# EAGLE design Akvarij1_0 (EAGLE 5.10)
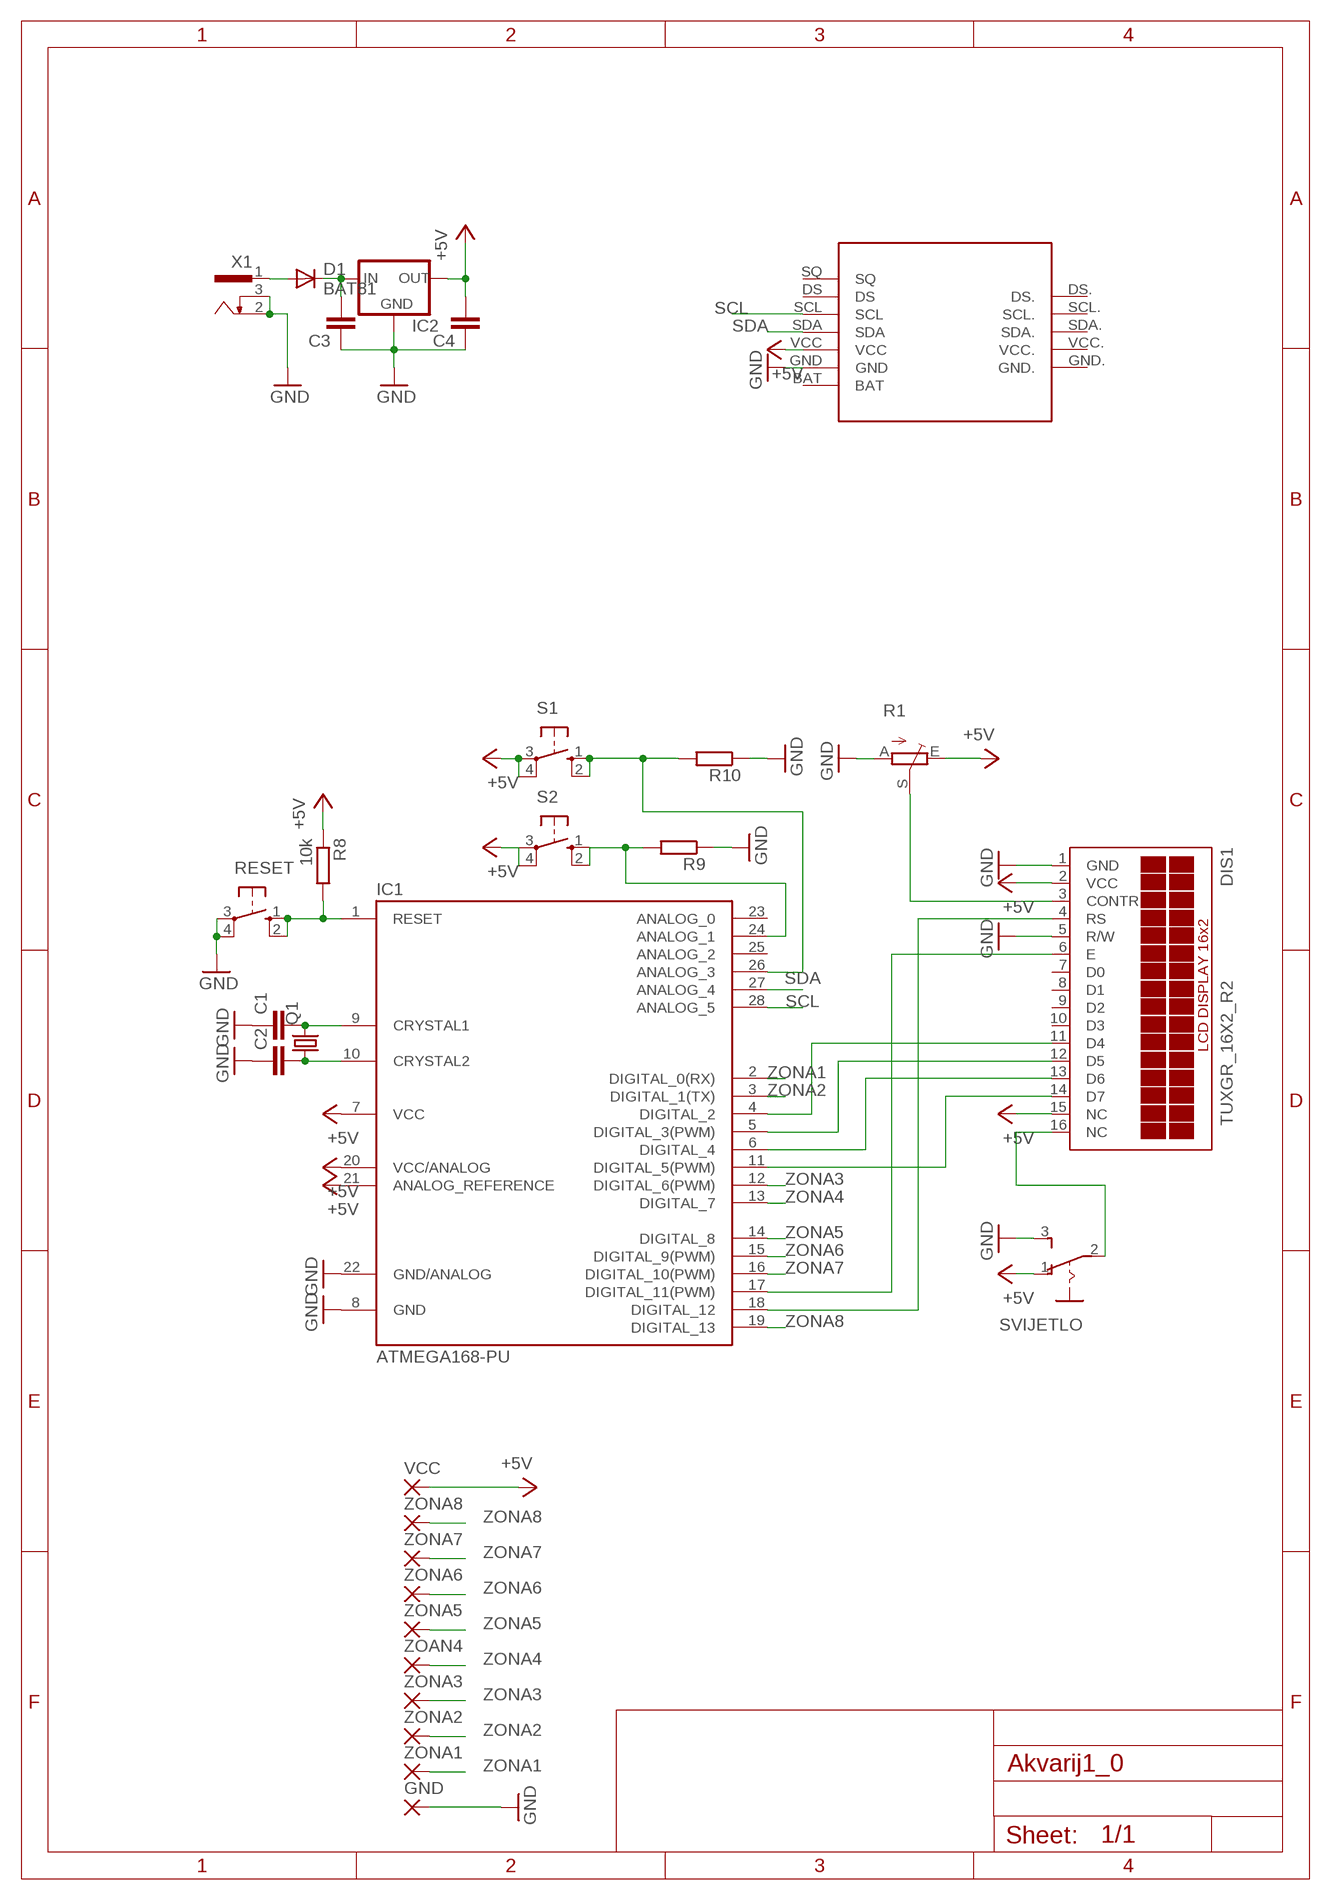
[diagram p0: schematic, sheet 1]

## Parts
C1  C-EU050-045X075  [C050-045X075]
C2  C-EU050-045X075  [C050-045X075]
C3  C-EU050-045X075  [C050-045X075]
C4  C-EU050-045X075  [C050-045X075]
D1  BAT81  [DO34-7]
DIS1  TUXGR_16X2_R2  [TUXGR_16X2_R2]
GND  2,15/1,0  [2,15/1,0]
IC1  ATMEGA168-PU  [DIL28-3]
IC2  78MXXS  [78MXXS]
Q1  CRYSTALHC18U-V  [HC18U-V]
R1  TRIM_EU-CA6V  [CA6V]
R8  10k  R-EU_0207/7  [0207/7]
R9  R-EU_0207/7  [0207/7]
R10  R-EU_0207/7  [0207/7]
RESET  10-XX  [B3F-10XX]
S1  10-XX  [B3F-10XX]
S2  10-XX  [B3F-10XX]
SVIJETLO  255SB  [255SB]
U$1  RTC  [RTC]
VCC  2,15/1,0  [2,15/1,0]
X1  733980-62  [733980-62]
ZOAN4  2,15/1,0  [2,15/1,0]
ZONA1  2,15/1,0  [2,15/1,0]
ZONA2  2,15/1,0  [2,15/1,0]
ZONA3  2,15/1,0  [2,15/1,0]
ZONA5  2,15/1,0  [2,15/1,0]
ZONA6  2,15/1,0  [2,15/1,0]
ZONA7  2,15/1,0  [2,15/1,0]
ZONA8  2,15/1,0  [2,15/1,0]

## Nets
+5V: C4.2 DIS1.2(VCC) DIS1.15(NC) IC1.7(VCC) IC1.20(VCC/ANALOG) IC1.21(ANALOG_REFERENCE) IC2.OUT R1.E R8.1 S1.3(P) S1.4(P1) S2.3(P) S2.4(P1) SVIJETLO.1(O) U$1.VCC VCC.1(P)
GND: C1.1 C2.1 C3.1 C4.1 DIS1.1(GND) DIS1.5(R/W) GND.1(P) IC1.8(GND) IC1.22(GND/ANALOG) IC2.GND R1.A R9.1 R10.1 RESET.3(P) RESET.4(P1) SVIJETLO.3(S) U$1.GND X1.2 X1.3
N$13: DIS1.3(CONTR) R1.S
N$15: C1.2 IC1.9(CRYSTAL1) Q1.2
N$16: C2.2 IC1.10(CRYSTAL2) Q1.1
N$17: C3.2 D1.C IC2.IN
N$18: D1.A X1.1
N$19: DIS1.4(RS) IC1.18(DIGITAL_12)
N$20: DIS1.6(E) IC1.17(DIGITAL_11(PWM))
N$21: DIS1.14(D7) IC1.11(DIGITAL_5(PWM))
N$22: DIS1.13(D6) IC1.6(DIGITAL_4)
N$23: DIS1.12(D5) IC1.5(DIGITAL_3(PWM))
N$24: DIS1.11(D4) IC1.4(DIGITAL_2)
N$25: IC1.26(ANALOG_3) R10.2 S1.1(S) S1.2(S1)
N$26: IC1.24(ANALOG_1) R9.2 S2.1(S) S2.2(S1)
N$27: DIS1.16(NC) SVIJETLO.2(P)
N$30: IC1.1(RESET) R8.2 RESET.1(S) RESET.2(S1)
SCL: IC1.28(ANALOG_5) U$1.SCL
SDA: IC1.27(ANALOG_4) U$1.SDA
ZONA1: IC1.2(DIGITAL_0(RX)) ZONA1.1(P)
ZONA2: IC1.3(DIGITAL_1(TX)) ZONA2.1(P)
ZONA3: IC1.12(DIGITAL_6(PWM)) ZONA3.1(P)
ZONA4: IC1.13(DIGITAL_7) ZOAN4.1(P)
ZONA5: IC1.14(DIGITAL_8) ZONA5.1(P)
ZONA6: IC1.15(DIGITAL_9(PWM)) ZONA6.1(P)
ZONA7: IC1.16(DIGITAL_10(PWM)) ZONA7.1(P)
ZONA8: IC1.19(DIGITAL_13) ZONA8.1(P)
Unconnected: DIS1.7(D0) DIS1.8(D1) DIS1.9(D2) DIS1.10(D3) IC1.23(ANALOG_0) IC1.25(ANALOG_2) U$1.BAT U$1.DS U$1.DS. U$1.GND. U$1.SCL. U$1.SDA. U$1.SQ U$1.VCC.

## Library data of the parts
C1-C4 = rcl:C-EU: CAPACITOR, European symbol
D1 = diode:BAT81: DIODE barrier diode
DIS1 = display-lcd:TUXGR_16X2_R2: Tuxgraphics LCD display 16x2 characters reflective, without background light Source: tuxgr_12x2_r2.pdf
GND VCC ZOAN4 ZONA1-ZONA3 ZONA5-ZONA8 = wirepad:2,15/1,0: THROUGH-HOLE PAD
IC1 = Arduino-AVR:ATMEGA168-PU
IC2 = v-reg:78MXXS: VOLTAGE REGULATOR
Q1 = crystal:CRYSTAL: CRYSTAL
R1 = pot:TRIM_EU-: POTENTIOMETER
R8-R10 = rcl:R-EU_: RESISTOR, European symbol
RESET S1 S2 = switch-omron:10-XX: OMRON SWITCH
SVIJETLO = switch:255SB: SLIDING SWITCH Distributor Buerklin, 11G810
U$1 = RTC:RTC
X1 = con-conrad:73398?: FEMALE PRINT CONNECTOR Niedervolt-Steckverbinder Distributor Conrad

## Board
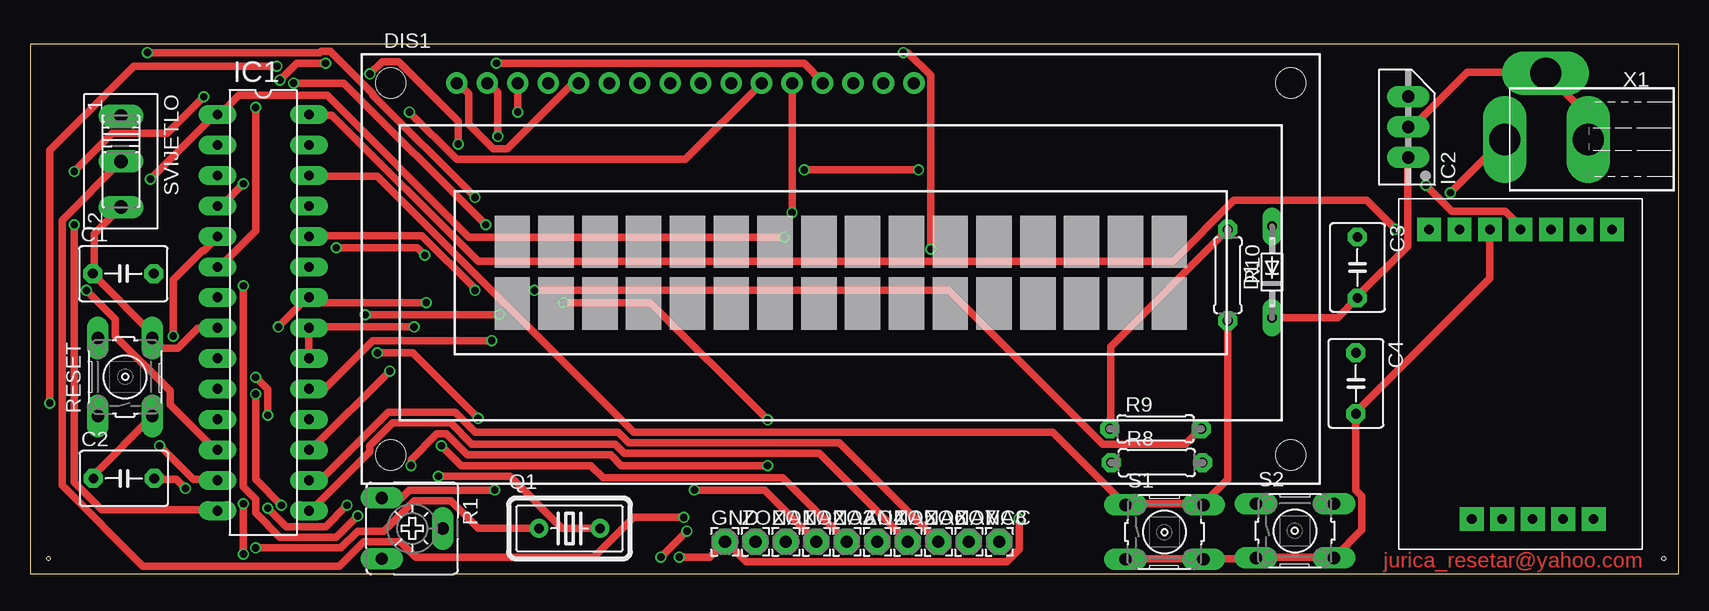
[diagram p1: board, top side]
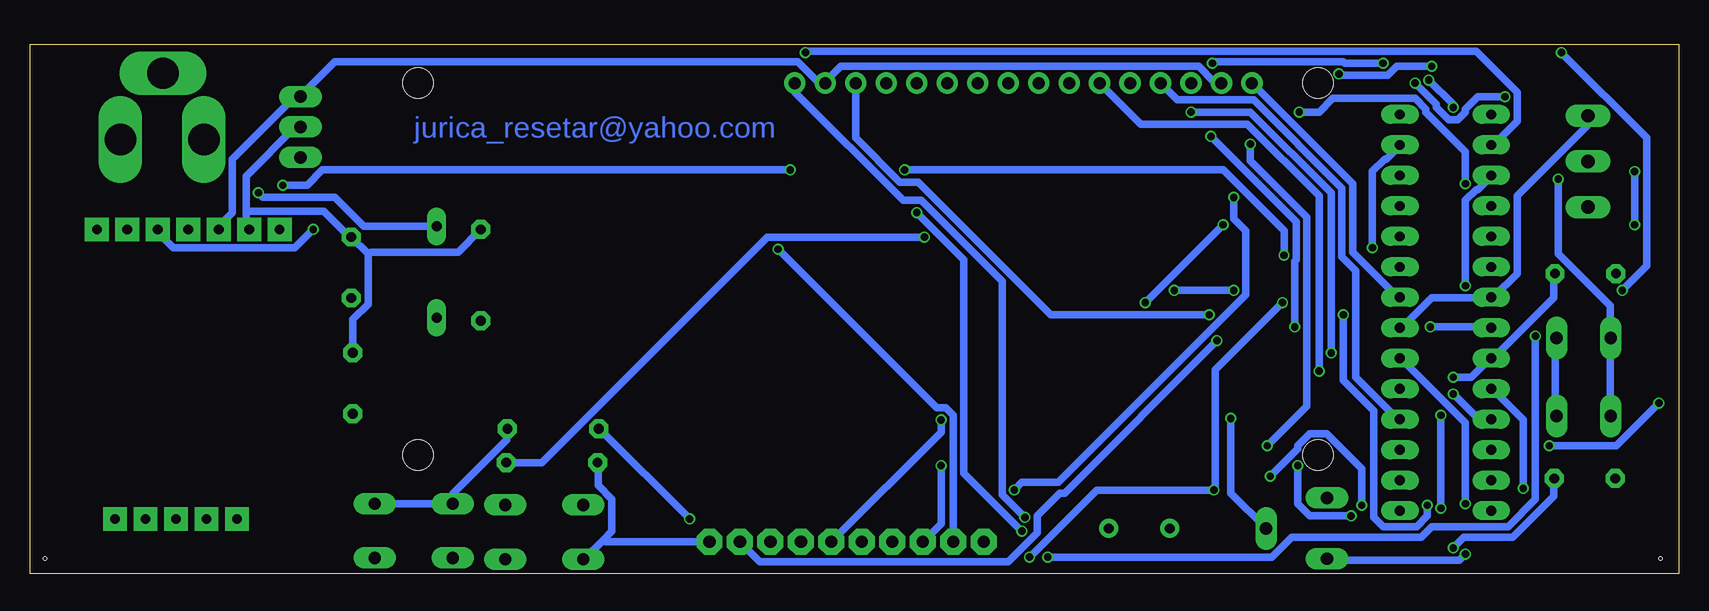
[diagram p2: board, bottom side, seen from below]

Size 137.39 x 44.12 mm. Coordinates in mm from the lower left corner, seen from the top.
Outline: 0,0 137.39,0 137.39,44.12 0,44.12 0,0
Copper layers (1*16): Top 0.035mm / dielectric 1.5mm / Bottom 0.035mm
Design rules "default *": minimum track width 25mil, minimum drill 24mil, track to track 7mil, track to pad 7mil, pad to pad 7mil, via to via 7mil, smd to smd 8mil, copper to edge 5mil, drill to drill 8mil, minimum pad ring 15mil, minimum via ring 5mil, stop-mask expansion 4mil, vias tented up to drill 0mil, thermal gap 10mil
Holes 0.28 mm at 136.14,1.27 1.52,1.27

### Footprints (pad centres in the part's own frame; a part is rotated, then mirrored left to right if it is on the bottom)
C050-045X075 = drill 0.813 octagon: 1 -2.54,0; 2 2.54,0
DO34-7 = drill 0.813 long: A 3.81,0; C -3.81,0
TUXGR_16X2_R2 = drill 1 pad 1.676 round: 1 -32,15.5; 2 -29.46,15.5; 3 -26.92,15.5; 4 -24.38,15.5; 5 -21.84,15.5; 6 -19.3,15.5; 7 -16.76,15.5; 8 -14.22,15.5; 9 -11.68,15.5; 10 -9.14,15.5; 11 -6.6,15.5; 12 -4.06,15.5; 13 -1.52,15.5; 14 1.02,15.5; 15 3.56,15.5; 16 6.1,15.5 | hole 2.5: -37.5,-15.5; 37.5,-15.5; -37.5,15.5; 37.5,15.5
2,15/1,0 = drill 1.016 pad 2.159 octagon: 1 0,0
DIL28-3 = drill 0.813 long: 1 -16.51,-3.81; 2 -13.97,-3.81; 3 -11.43,-3.81; 4 -8.89,-3.81; 5 -6.35,-3.81; 6 -3.81,-3.81; 7 -1.27,-3.81; 8 1.27,-3.81; 9 3.81,-3.81; 10 6.35,-3.81; 11 8.89,-3.81; 12 11.43,-3.81; 13 13.97,-3.81; 14 16.51,-3.81; 15 16.51,3.81; 16 13.97,3.81; 17 11.43,3.81; 18 8.89,3.81; 19 6.35,3.81; 20 3.81,3.81; 21 1.27,3.81; 22 -1.27,3.81; 23 -3.81,3.81; 24 -6.35,3.81; 25 -8.89,3.81; 26 -11.43,3.81; 27 -13.97,3.81; 28 -16.51,3.81
78MXXS = drill 1.016 long: GND 0,-2.54; IN -2.54,-2.54; OUT 2.54,-2.54
HC18U-V = drill 0.813 round: 1 -2.54,0; 2 2.54,0
CA6V = drill 1.016 long: A -2.54,-2.54; E 2.54,-2.54; S 0,2.54
0207/7 = drill 0.813 octagon: 1 -3.81,0; 2 3.81,0
B3F-10XX = drill 1.016 long: 1 -3.251,2.261; 2 3.251,2.261; 3 -3.251,-2.261; 4 3.251,-2.261
255SB = drill 1.118 long: 1 -3.81,0; 2 0,0; 3 3.81,0
RTC = drill 0.8 pad 1.981 square: BAT 0,0; DS 0,12.7; DS. 24.13,13.716; GND 0,2.54; GND. 24.13,3.556; SCL 0,10.16; SCL. 24.13,11.176; SDA 0,7.62; SDA. 24.13,8.636; SQ 0,15.24; VCC 0,5.08; VCC. 24.13,6.096
733980-62 = drill 2.6 pad 3 long: 1 0,9.108; 2 0,2.146; 3 5.508,5.7

### Placement (x,y rotation side)
C1  7.77,25.02 0 top
C2  7.82,7.95 0 top
C3  110.62,25.53 270 top
C4  110.49,15.88 270 top
D1  103.5,25.15 90 top
DIS1  67.56,25.4 0 top
GND  57.91,2.67 0 top
IC1  19.43,21.77 270 top
IC2  112.32,37.24 90 top
Q1  44.96,3.78 0 top
R1  31.85,3.78 270 top
R8  93.9,9.27 0 top
R9  93.8,12.09 0 top
R10  99.82,24.89 270 top
RESET  7.92,16.41 90 top
S1  94.54,3.48 0 top
S2  105.41,3.58 0 top
SVIJETLO  7.57,34.37 270 top
U$1  116.59,28.7 270 top
VCC  80.77,2.67 0 top
X1  132,36.2 90 top
ZOAN4  68.07,2.67 0 top
ZONA1  60.45,2.67 0 top
ZONA2  62.99,2.67 0 top
ZONA3  65.53,2.67 0 top
ZONA5  70.61,2.67 0 top
ZONA6  73.15,2.67 0 top
ZONA7  75.69,2.67 0 top
ZONA8  78.23,2.67 0 top

### Tracks (layer width: path | path; a pad name or v marks a point on that pad's centre or on a via)
+5V  (via drill 0.61)
  Top 0.635: IC1.20 IC1.21 23.5,20.57 v32,20.57 | v17.78,1.65 v17.78,5.84 | U$1.VCC 121.67,24.64 110.62,13.59 C4.2 110.49,6.98 111,6.48 111,3.68 108.71,1.4 S2.4 108.33,1.4 102.36,1.4 S2.3 102.11,1.27 97.79,1.27 S1.4 97.54,1.27 91.31,1.27 S1.3 | v38.99,36.45 38.99,40.13 38.23,40.89 DIS1.2
  Bottom 0.635: IC1.21 23.24,20.57 22.99,20.57 20.57,22.99 15.62,22.99 IC1.7 15.37,23.11 13.46,25.02 13.46,31.5 7.62,37.34 7.62,38.1 SVIJETLO.1 | v17.78,1.65 18.29,1.14 29.21,1.14 R1.E | v17.78,5.84 17.78,12.57 23.24,18.03 IC1.20 | DIS1.2 38.23,41.02 38.73,41.02 40,42.29 69.85,42.29 71.12,41.02 DIS1.15 71.37,41.15 71.88,41.15 73.41,42.67 112.01,42.67 114.68,40.01 IC2.OUT 114.94,39.75 115.32,39.75 120.52,34.54 120.52,30.1 121.67,28.96 U$1.VCC | 89.6,2.86 91.19,1.27 S1.3 | 89.6,2.86 88.9,3.56 88.9,6.22 90.04,7.37 90.04,9.27 R8.1 | VCC.1 89.41,2.67 89.6,2.86 | v32,20.57 32,26.04 31.88,26.16 31.88,29.34 v38.99,36.45
GND  (via drill 0.61)
  Top 0.635: X1.2 129.79,36.2 129.79,38.23 126.37,41.66 X1.3 125.98,41.78 119.76,41.78 115.32,37.34 114.94,37.34 IC2.GND | R10.1 90.04,18.92 90.04,12.19 R9.1 | v38.73,6.98 31.62,6.98 30.99,6.35 29.34,6.35 R1.A | v54.1,1.4 56.64,1.4 GND.1 58.17,2.54 59.69,1.02 81.41,1.02 82.42,2.03 v82.42,4.57 | SVIJETLO.3 5.33,28.32 5.33,25.02 C1.1 5.46,24.77 10.29,19.94 RESET.4 11.05,18.8 12.32,18.8 13.97,20.45 15.62,20.45 IC1.8 | C2.1 5.33,8 5.33,8.26 10.16,13.08 RESET.3 | DIS1.5 45.21,40.89 39.75,35.43 38.61,35.43 36.58,37.47 36.58,40.01 35.69,40.89 DIS1.1 | v20.7,20.57 23.24,23.11 IC1.22 23.11,22.61 v33.02,22.61
  Bottom 0.635: 119.38,30.23 119.38,28.96 U$1.GND | 119.38,30.23 119.38,33.15 115.32,37.21 114.94,37.21 IC2.GND | C4.1 110.49,21.21 109.22,22.48 109.22,26.67 | 109.22,26.67 C3.1 110.87,28.19 112.9,30.23 119.38,30.23 | R10.1 101.73,26.8 108.97,26.8 109.22,26.67 | v54.1,1.4 48.51,6.98 v38.73,6.98 38.61,7.24 38.61,17.02 v33.02,22.61 | RESET.4 10.29,19.56 10.29,13.21 RESET.3 | IC1.22 23.24,23.11 23.5,23.11 27.18,26.8 27.18,32.51 DIS1.1 | v20.7,20.57 15.62,20.57 IC1.8 | v82.42,4.57 89.92,12.06 R9.1
N$13  (via drill 0.61)
  Top 0.635: v40.64,38.48 DIS1.3 | v28.96,18.41 31.88,18.41 v37.34,12.95
  Bottom 0.635: v40.64,38.48 35.69,38.48 28.96,31.75 v28.96,18.41 | v37.34,12.95 37.34,6.73 R1.S
N$15  (via drill 0.61)
  Top 0.635: v34.04,8.13 40,8.13 44.32,3.81 47.5,3.81 Q1.2 | v26.42,5.71 24.64,3.94 21.34,3.94 v19.81,5.46 | v19.81,13.21 19.81,15.37 v18.8,16.38
  Bottom 0.635: C1.2 10.41,25.02 10.41,22.99 15.37,18.03 15.62,18.03 IC1.9 15.88,17.78 17.27,16.38 v18.8,16.38 | v34.04,8.13 31.75,10.41 31.75,10.67 30.73,11.68 29.34,11.68 26.42,8.76 v26.42,5.71 | v19.81,5.46 v19.81,13.21
N$16  (via drill 0.61)
  Top 0.635: v12.95,7.11 12.19,7.87 10.41,7.87 C2.2 | v18.8,2.16 25.91,2.16 27.31,3.56 29.46,3.56 32,6.1 35.05,6.1 37.34,3.81 42.42,3.81 Q1.1
  Bottom 0.635: v12.95,7.11 12.95,12.83 15.62,15.49 IC1.10 | v18.8,2.16 17.91,3.05 13.84,3.05 10.41,6.48 10.41,7.87 C2.2
N$17
  Top 0.635: D1.C 108.97,21.34 C3.2 110.74,23.24 114.81,27.3 114.81,34.67 IC2.IN
N$18  (via drill 0.61)
  Top 0.635: v118.36,31.75 122.81,36.2 X1.1
  Bottom 0.635: D1.A 109.6,28.96 112.01,31.37 117.98,31.37 v118.36,31.75
N$19
  Bottom 0.635: IC1.18 23.24,12.95 23.5,12.95 26.92,16.38 26.92,25.27 28.07,26.42 28.07,32.13 35.43,39.5 41.78,39.5 DIS1.4
N$20  (via drill 0.61)
  Top 0.635: v29.97,16.89 23.5,10.41 23.24,10.41 IC1.17
  Bottom 0.635: v29.97,16.89 29.97,31.5 35.94,37.47 44.83,37.47 DIS1.6
N$21  (via drill 0.61)
  Top 0.635: v18.8,14.99 18.8,7.87 v20.95,5.71 | v27.94,21.59 v39.12,21.59
  Bottom 0.635: v18.8,14.99 16.76,12.95 15.62,12.95 IC1.11 | v20.95,5.71 20.95,4.83 21.84,3.94 24.64,3.94 25.4,4.7 25.4,13.59 27.94,16.13 v27.94,21.59 | v39.12,21.59 52.32,21.59 63.37,32.64 64.9,32.64 68.58,36.32 DIS1.14
N$22  (via drill 0.61)
  Top 0.635: v18.8,38.86 18.8,28.57 15.88,25.65 15.62,25.65 IC1.6 | v20.83,41.15 22.23,42.55 v24.64,42.55 | v38.86,42.55 64.52,42.55 66.04,41.02 DIS1.13
  Bottom 0.635: v18.8,38.86 18.8,39.12 v20.83,41.15 | v24.64,42.55 27.81,42.55 27.94,42.67 38.73,42.67 v38.86,42.55
N$23  (via drill 0.61)
  Top 0.635: v11.94,19.81 11.94,24.51 14.35,26.92 14.48,26.92 15.62,28.07 IC1.5 | v52.58,1.4 v54.74,3.56 | v63.5,30.1 DIS1.12
  Bottom 0.635: v11.94,19.81 11.94,6.22 14.22,3.94 20.57,3.94 21.46,3.05 32.26,3.05 33.91,1.4 v52.58,1.4 | v54.74,3.56 59.56,8.38 59.56,26.16 v63.5,30.1
N$24  (via drill 0.61)
  Top 0.635: v17.78,32.51 16,30.73 15.62,30.73 IC1.4 | v31.62,38.48 35.56,34.54 54.61,34.54 DIS1.11
  Bottom 0.635: v17.78,32.51 17.78,35.18 21.08,38.48 21.08,38.74 21.97,39.62 28.83,39.62 29.97,38.48 v31.62,38.48
N$25
  Top 0.635: R10.2 99.82,7.87 97.79,5.84 S1.2 97.54,5.84 91.57,5.84 S1.1 85.22,11.81 50.29,11.81 28.96,33.15 23.24,33.15 IC1.26
N$26  (via drill 0.61)
  Top 0.635: v37.08,23.62 37.08,23.75 32.64,28.19 23.24,28.19 IC1.24 | v42.04,23.62 76.58,23.62 89.41,10.79 96.27,10.79 97.54,12.06 R9.2
  Bottom 0.635: R9.2 97.66,12.06 97.66,11.18 102.11,6.73 102.11,5.84 S2.1 S2.2 | v37.08,23.62 v42.04,23.62
N$27  (via drill 0.61)
  Top 0.635: v54.48,4.7 50.29,4.7 46.99,1.4 32.13,1.4 30.86,2.67 27.81,2.67 25.78,0.64 9.4,0.64 2.67,7.37 2.67,29.46 SVIJETLO.2
  Bottom 0.635: v54.48,4.7 56.39,6.6 56.39,24.38 63.12,31.11 64.64,31.11 73.66,40.13 DIS1.16
N$30  (via drill 0.61)
  Top 0.635: v10.03,32.89 15.37,38.23 15.62,38.23 IC1.1 15.88,38.35 17.4,39.88 24.77,39.88 36.58,28.07 v62.86,28.07
  Bottom 0.635: v10.03,32.89 10.03,26.67 5.71,22.35 5.71,19.68 RESET.2 5.71,19.43 5.71,13.21 RESET.1 | v62.86,28.07 75.95,28.07 94.74,9.27 R8.2
SCL  (via drill 0.61)
  Top 0.635: v113.79,28.7 111.38,31.11 100.33,31.11 95.25,26.04 37.34,26.04 25.15,38.23 23.24,38.23 IC1.28
  Bottom 0.635: v113.79,28.7 115.32,27.18 125.48,27.18 126.75,28.45 U$1.SCL
SDA  (via drill 0.61)
  Top 0.635: v25.53,27.18 32.26,27.18 v32.89,26.54 | v64.52,33.66 v74.04,33.66 | v116.33,32.38 118.49,30.23 122.94,30.23 124.21,28.96 U$1.SDA
  Bottom 0.635: v25.53,27.18 25.53,33.53 24.51,34.54 24.38,34.54 23.24,35.69 IC1.27 | v32.89,26.54 32.89,28.57 37.97,33.66 v64.52,33.66 | v74.04,33.66 113.03,33.66 114.3,32.38 v116.33,32.38
ZONA1  (via drill 0.61)
  Top 0.635: v72.77,43.43 73.15,43.43 75.06,41.53 v75.06,27.05
  Bottom 0.635: v72.77,43.43 72.64,43.56 16.89,43.56 13.46,40.13 13.46,37.72 15.37,35.81 15.62,35.81 IC1.2 | v75.06,27.05 61.85,13.84 61.09,13.84 60.45,13.21 ZONA1.1
ZONA2  (via drill 0.61)
  Top 0.635: v17.78,24 17.78,7.24 18.8,6.22 18.8,5.08 20.83,3.05 25.53,3.05 v27.31,4.83 | v31.75,9.02 31.75,9.53 33.91,11.68 34.67,11.68 36.45,9.91 48.39,9.91 49.28,9.02 v61.47,9.02
  Bottom 0.635: v17.78,24 17.78,31.11 16.89,32 16.76,32 15.62,33.15 IC1.3 | v27.31,4.83 30.73,4.83 31.75,5.84 v31.75,9.02 | v61.47,9.02 61.47,4.19 ZONA2.1
ZONA3  (via drill 0.61)
  Top 0.635: v4.7,23.62 7.11,21.21 7.11,19.81 11.68,15.24 11.68,14.1 15.37,10.41 15.62,10.41 IC1.12 | v9.78,43.43 24.13,43.43 24.26,43.56 25.02,43.56 28.57,40.01 28.57,39.88 v37.08,31.37 | v55.37,6.98 61.21,6.98 ZONA3.1
  Bottom 0.635: v4.7,23.62 2.67,25.65 2.67,36.32 v9.78,43.43 | v37.08,31.37 37.08,29.59 36.07,28.57 36.07,23.24 51.69,7.62 54.74,7.62 v55.37,6.98
ZONA4  (via drill 0.61)
  Top 0.635: v10.79,10.67 13.59,7.87 15.62,7.87 IC1.13 | v1.65,14.22 1.65,35.31 8.64,42.29 v20.57,42.29 | v28.32,41.66 29.34,42.67 30.73,42.67 35.69,37.72 v35.69,35.81 | v34.29,10.67 35.94,9.02 46.74,9.02 47.75,8 62.74,8 ZOAN4.1
  Bottom 0.635: v10.79,10.67 5.21,10.67 v1.65,14.22 | v20.57,42.29 23.5,42.29 24.26,41.53 28.19,41.53 v28.32,41.66 | v35.69,35.81 35.69,34.42 30.99,29.72 30.99,13.97 v34.29,10.67
ZONA5  (via drill 0.61)
  Top 0.635: v3.68,29.08 3.68,7.62 5.97,5.33 15.62,5.33 IC1.14 | v3.68,33.53 6.86,36.7 11.43,36.7 v14.48,39.75 | v21.97,40.89 26.16,40.89 v37.97,29.08 | v44.45,22.61 51.69,22.61 v61.47,12.83
  Bottom 0.635: v3.68,29.08 v3.68,33.53 | v14.48,39.75 16.76,39.75 17.78,38.74 17.78,38.48 18.41,37.85 19.18,37.85 20.19,38.86 20.19,39.12 v21.97,40.89 | v37.97,29.08 v44.45,22.61 | v61.47,12.83 61.47,11.81 ZONA5.1
ZONA6
  Top 0.635: ZONA6.1 65.79,10.03 49.53,10.03 48.77,10.79 36.83,10.79 35.05,12.57 30.23,12.57 28.32,10.67 28.32,10.16 23.5,5.33 23.24,5.33 IC1.15
ZONA7
  Top 0.635: ZONA7.1 67.44,10.92 49.91,10.92 49.02,11.81 37.08,11.81 35.43,13.46 29.85,13.46 24.26,7.87 23.24,7.87 IC1.16
ZONA8  (via drill 0.61)
  Top 0.635: v38.48,19.43 28.57,19.43 24.64,15.49 23.24,15.49 IC1.19
  Bottom 0.635: v38.48,19.43 51.18,6.73 51.56,6.73 53.47,4.83 53.47,3.43 55.88,1.02 76.58,1.02 ZONA8.1

### Text on the board
Top: jurica_resetar@yahoo.com
Bottom: jurica_resetar@yahoo.com